# EAGLE design BazzFussNoBypass (EAGLE 7.1.0)
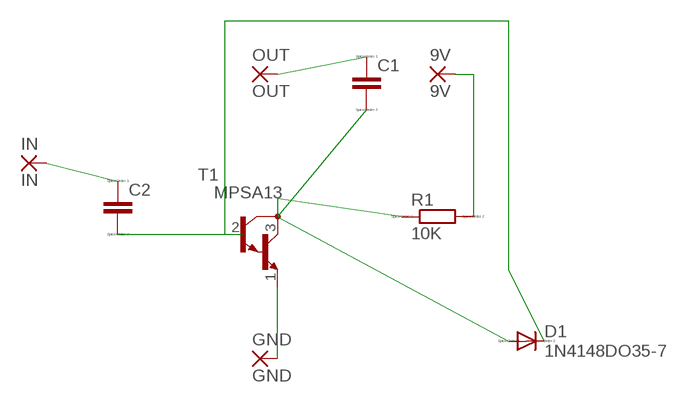
[diagram p0: schematic, sheet 1]

## Parts
9V  9V  1,6/0,8  [1,6/0,8]
C1  C-EU025-025X050  [C025-025X050]
C2  C-EU025-025X050  [C025-025X050]
D1  1N4148DO35-7  [DO35-7]
GND  GND  1,6/0,8  [1,6/0,8]
IN  IN  1,6/0,8  [1,6/0,8]
OUT  OUT  1,6/0,8  [1,6/0,8]
R1  10K  R0207/10  [0207/10]
T1  MPSA13  BC517  [TO92]

## Nets
1N4148: C1.2 D1.A R1.1 T1.3(C)
9V: 9V.1(P) R1.2
GND: GND.1(P) T1.1(E)
IN: C2.1 IN.1(P)
N$2: C2.2 D1.C T1.2(B)
OUT: C1.1 OUT.1(P)

## Library data of the parts
9V GND IN OUT = wirepad:1,6/0,8: THROUGH-HOLE PAD
C1 C2 = resistor:C-EU: CAPACITOR, European symbol; SPICEPREFIX: C
D1 = diode:1N4148: DIODE high speed (Philips)
R1 = eagle-ltspice:R: RESISTOR, European symbol; SPICEMODEL: NONE; SPICEPREFIX: R
T1 = transistor:BC517: NPN BIPOLAR DARLINGTON TRANSISTOR

## Board
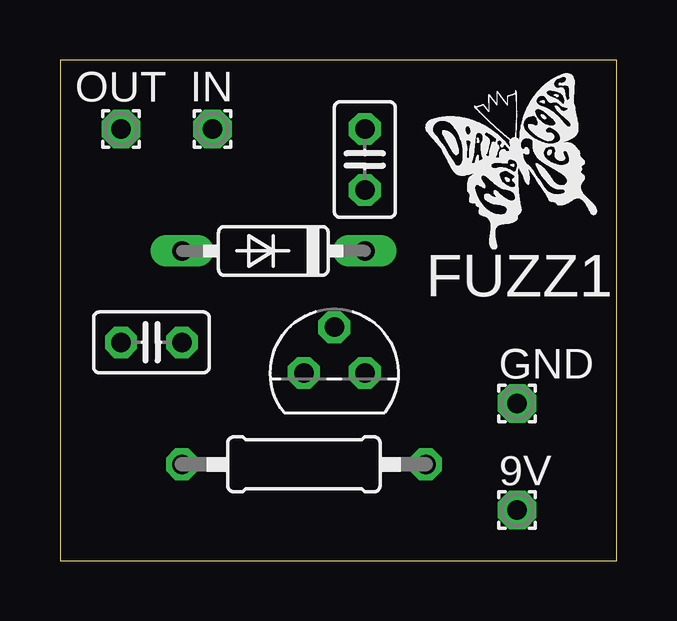
[diagram p1: board, top side]
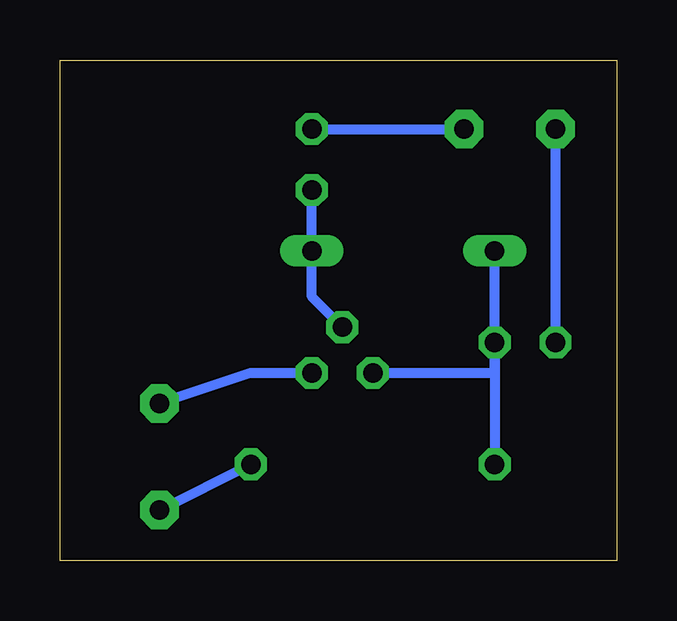
[diagram p2: board, bottom side, seen from below]

Size 23.19 x 20.86 mm. Coordinates in mm from the lower left corner, seen from the top.
Outline: 0,0 23.19,0 23.19,20.86 0,20.86 0,0
Copper layers (1*16): Top 0.035mm / dielectric 1.5mm / Bottom 0.035mm
Design rules "default": minimum track width 10mil, minimum drill 24mil, track to track 8mil, track to pad 8mil, pad to pad 8mil, via to via 8mil, smd to smd 8mil, copper to edge 40mil, drill to drill 8mil, minimum pad ring 10mil, minimum via ring 8mil, stop-mask expansion 4mil, vias tented up to drill 0mil, thermal gap 10mil

### Footprints (pad centres in the part's own frame; a part is rotated, then mirrored left to right if it is on the bottom)
1,6/0,8 = drill 0.813 pad 1.6 octagon: 1 0,0
C025-025X050 = drill 0.813 octagon: 1 -1.27,0; 2 1.27,0
DO35-7 = drill 0.813 long: A 3.81,0; C -3.81,0
0207/10 = drill 0.813 octagon: 1 -5.08,0; 2 5.08,0
TO92 = drill 0.813 octagon: 1 1.27,0; 2 0,1.905; 3 -1.27,0

### Placement (x,y rotation side)
9V  19.05,2.11 0 top
C1  3.81,9.09 0 top
C2  12.7,16.71 270 top
D1  8.89,12.9 180 top
GND  19.05,6.55 0 top
IN  6.35,17.98 0 top
OUT  2.54,17.98 0 top
R1  10.16,4.01 0 top
T1  11.43,7.82 0 top

### Tracks (layer width: path | path; a pad name or v marks a point on that pad's centre or on a via)
1N4148
  Bottom 0.406: C1.2 D1.A | C1.2 R1.1 | T1.3 5.08,7.82 C1.2
9V
  Bottom 0.406: 9V.1 R1.2
GND
  Bottom 0.406: GND.1 15.24,7.82 T1.1
IN
  Bottom 0.406: C2.1 IN.1
N$2
  Bottom 0.406: T1.2 12.7,11 D1.C C2.2
OUT
  Bottom 0.406: C1.1 OUT.1

### Text on the board
tNames: FUZZ1